# EAGLE design KGGRS2 (EAGLE 8.2.1)
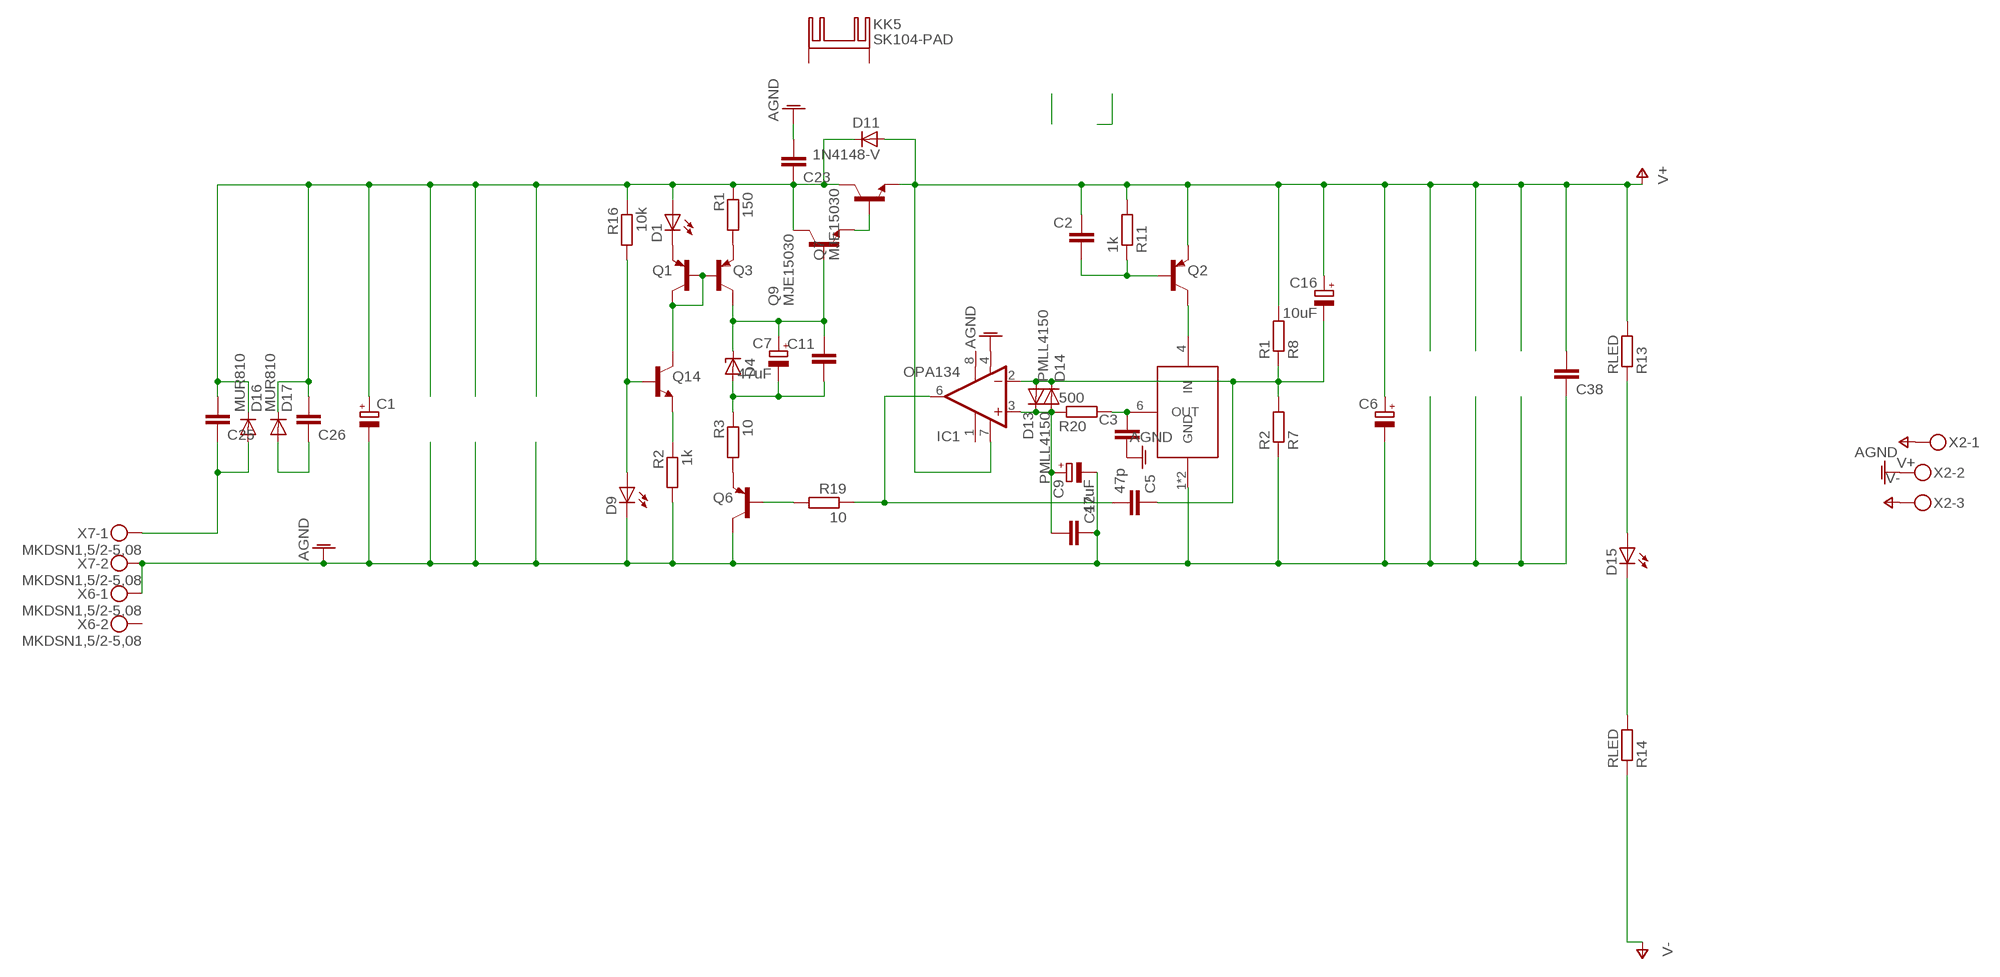
[diagram p0: schematic, sheet 1]

## Parts
C1  CPOL-EUE10-35  [EB35D]
C2  C-EUC1206  [C1206]
C3  C-EUC1206  [C1206]
C5  47p  C-EUC1206  [C1206]
C6  CPOL-EUE5-13  [E5-13]
C7  47uF  CPOL-EUSP-CAP-CX  [SP-CAP-CX]
C9  47uF  CPOL-EUSP-CAP-CX  [SP-CAP-CX]
C11  C-EUC1206  [C1206]
C12  C-EU050-035X075  [C050-035X075]
C16  10uF  CPOL-EUSP-CAP-CX  [SP-CAP-CX]
C23  C-EU050-075X075  [C050-075X075]
C25  C-EU050-035X075  [C050-035X075]
C26  C-EU050-035X075  [C050-035X075]
C38  C-EU050-035X075  [C050-035X075]
D1  LED5MM  [LED5MM]
D4  ZENER-DIODESOD80C  [SOD80C]
D9  LED5MM  [LED5MM]
D11  1N4148-V  [1N4148]
D13  PMLL4150  [SOD80C]
D14  PMLL4150  [SOD80C]
D15  LED5MM  [LED5MM]
D16  MUR810  [TO220ACS]
D17  MUR810  [TO220ACS]
IC1  OPA134  OPA134U  [SO08]
KK5  SK104-PAD  [SK104-PAD]
Q1  MMBTA92LT1-PNP-SOT23-BEC  [SOT23-BEC]
Q2  MMBTA92LT1-PNP-SOT23-BEC  [SOT23-BEC]
Q3  MMBTA92LT1-PNP-SOT23-BEC  [SOT23-BEC]
Q6  MMBTA92LT1-PNP-SOT23-BEC  [SOT23-BEC]
Q7  MJE15030  [TO220KG]
Q9  MJE15030  [TO220KG]
Q14  MMBTA42LT1-NPN-SOT23-BEC  [SOT23-BEC]
R1  150  R-EU_MELF0204W  [MINI_MELF-0204W]
R2  1k  R-EU_MELF0204W  [MINI_MELF-0204W]
R3  10  R-EU_MELF0204W  [MINI_MELF-0204W]
R7  R2  R-EU_MELF0204W  [MINI_MELF-0204W]
R8  R1  R-EU_MELF0204W  [MINI_MELF-0204W]
R11  1k  R-EU_MELF0204W  [MINI_MELF-0204W]
R13  RLED  R-EU_MELF0204W  [MINI_MELF-0204W]
R14  RLED  R-EU_0207/2V  [0207/2V]
R16  10k  R-EU_MELF0204W  [MINI_MELF-0204W]
R19  10  R-EU_MELF0204W  [MINI_MELF-0204W]
R20  500  R-EU_MELF0204W  [MINI_MELF-0204W]
U$1  LTC6654  [SOT-23-6]
X2  MKDSN1,5/3-5,08  [MKDSN1,5/3-5,08]
X6  MKDSN1,5/2-5,08  [MKDSN1,5/2-5,08]
X7  MKDSN1,5/2-5,08  [MKDSN1,5/2-5,08]

## Nets
AGND: C1.- C3.2 C6.- C9.- C12.1 C23.2 C38.1 D9.K(C) IC1.4(V-) Q6.C R2.2 R7.1 U$1.1(GND) U$1.2(GND) X2.2 X6.1 X7.2
N$1: Q1.B Q1.C Q3.B Q14.C
N$2: D1.K(C) Q1.E
N$3: Q3.E R1.2
N$4: C1.+ C23.1 C25.2 C26.2 D1.A D11.C D16.C D17.C Q7.2(C) Q9.2(C) R1.1 R16.1
N$5: C7.+ C11.1 D4.C Q3.C Q9.1(B)
N$6: C7.- C11.2 D4.A R3.1
N$7: Q6.E R3.2
N$8: Q14.E R2.1
N$9: D9.A Q14.B R16.2
N$10: C3.1 R20.2 U$1.6(OUT)
N$11: C2.2 Q2.B R11.1
N$12: Q2.C U$1.4(IN)
N$21: Q7.1(B) Q9.3(E)
N$23: C25.1 D16.A X7.1
N$24: C5.2 IC1.6(OUT) R19.1
N$27: Q6.B R19.2
N$28: C5.1 C16.- D13.A D14.C IC1.2(-IN) R7.2 R8.1
N$31: C9.+ C12.2 D13.C D14.A IC1.3(+IN) R20.1
N$32: D15.K(C) R14.2
N$36: D15.A R13.1
N$59: C26.1 D17.A
V+: C2.1 C6.+ C16.+ C38.2 D11.A IC1.7(V+) Q2.E Q7.3(E) R8.2 R11.2 R13.2 X2.1
V-: R14.1 X2.3
Unconnected: IC1.1(TRIM1) IC1.8(TRIM2) KK5.K1(K) KK5.K2(K) X6.2

## Library data of the parts
C1 C6 C7 C9 C16 = Vwvwbg:CPOL-EU: POLARIZED CAPACITOR, European symbol
C2 C3 C5 C11 C12 C23 C25 C26 C38 = Vwvwbg:C-EU: CAPACITOR, European symbol
D1 D9 D15 = led:LED: LED OSRAM: - CHIPLED LG R971, LG N971, LY N971, LG Q971, LY Q971, LO R971, LY R971 LH N974, LH R974 LS Q976, LO Q976, LY Q976 LO Q996 - Hyper CHIPLED LW Q18S LB Q993, LB Q99A, LB R99A - SideLED LS A670, LO A670, LY A670, LG A670, LP A670 LB A673, LV A673, LT A673, LW A673 LH A674 LY A675 LS A676, LA A676, LO A676, LY A676, LW A676 LS A679, LY A679, LG A679 - Hyper Micro SIDELED® LS Y876, LA Y876, LO Y876, LY Y876 LT Y87S - SmartLED LW L88C, LW L88S LB L89C, LB L89S, LG L890 LS L89K, LO L89K, LY L89K LS L896, LA L896, LO L896, LY L896 - TOPLED LS T670, LO T670, LY T670, LG T670, LP T670 LSG T670, LSP T670, LSY T670, LOP T670, LYG T670 LG T671, LOG T671, LSG T671 LB T673, LV T673, LT T673, LW T673 LH T674 LS T676, LA T676, LO T676, LY T676, LB T676, LH T676, LSB T676, LW T676 LB T67C, LV T67C, LT T67C, LS T67K, LO T67K, LY T67K, LW E67C LS E67B, LA E67B, LO E67B, LY E67B, LB E67C, LV E67C, LT E67C LW T67C LS T679, LY T679, LG T679 LS T770, LO T770, LY T770, LG T770, LP T770 LB T773, LV T773, LT T773, LW T773 LH T774 LS E675, LA E675, LY E675, LS T675 LS T776, LA T776, LO T776, LY T776, LB T776 LHGB T686 LT T68C, LB T68C - Hyper Mini TOPLED® LB M676 - Mini TOPLED Santana® LG M470 LS M47K, LO M47K, LY M47K Source: http://www.osram.convergy.de LUXEON: - LUMILED® LXK2-PW12-R00, LXK2-PW12-S00, LXK2-PW14-U00, LXK2-PW14-V00 LXK2-PM12-R00, LXK2-PM12-S00, LXK2-PM14-U00 LXK2-PE12-Q00, LXK2-PE12-R00, LXK2-PE12-S00, LXK2-PE14-T00, LXK2-PE14-U00 LXK2-PB12-K00, LXK2-PB12-L00, LXK2-PB12-M00, LXK2-PB14-N00, LXK2-PB14-P00, LXK2-PB14-Q00 LXK2-PR12-L00, LXK2-PR12-M00, LXK2-PR14-Q00, LXK2-PR14-R00 LXK2-PD12-Q00, LXK2-PD12-R00, LXK2-PD12-S00 LXK2-PH12-R00, LXK2-PH12-S00 LXK2-PL12-P00, LXK2-PL12-Q00, LXK2-PL12-R00 Source: www.luxeon.com KINGBRIGHT: KA-3528ASYC Source: www.kingbright.com
D4 = diode:ZENER-DIODE: Z-Diode
D11 = diode:1N4148-V
D13 D14 = diode:PMLL4150: DIODE high speed
D16 D17 = diode:MUR810: DIODE
IC1 = burr-brown:OPA134: Operational Amplifiers SoundPlus(TM) High Performance Audio; MF: TEXAS INSTRUMENTS; MPN: OPA134UA; OC_FARNELL: 1097514; OC_NEWARK: 80K6009
KK5 = heatsink:SK104-PAD: HEATSINK manufacturer Fischer/distributor Buerklin
Q1-Q3 Q6 = transistor:*-PNP-: PNP Transistror
Q7 Q9 = transistor:MJE15030
Q14 = transistor:*-NPN-: NPN Transistror BF959 corrected 2008.03.06
R1-R3 R7 R8 R11 R13 R14 R16 R19 R20 = Vwvwbg:R-EU_: RESISTOR, European symbol
U$1 = Vwvwbg:LTC6654
X2 = con-phoenix-508:MKDSN1,5/3-5,08: MKDSN 1,5/ 3-5,08 Printklemme Nennstrom: 13,5 A Nennspannung: 250 V Rastermaß: 5,08 mm Polzahl: 3 Anschlussart: Schraubanschluss Montage: Löten Anschlussrichtung Leiter/Platine: 0 ° Artikelnummer: 1729131 Source: http://eshop.phoenixcontact.com .. 1729131.pdf
X6 X7 = con-phoenix-508:MKDSN1,5/2-5,08: MKDSN 1,5/ 2-5,08 Printklemme Nennstrom: 13,5 A Nennspannung: 250 V Rastermaß: 5,08 mm Polzahl: 2 Anschlussart: Schraubanschluss Montage: Löten Anschlussrichtung Leiter/Platine: 0 ° Artikelnummer: 1729128 Source: http://eshop.phoenixcontact.com .. 1729128.pdf

## Board
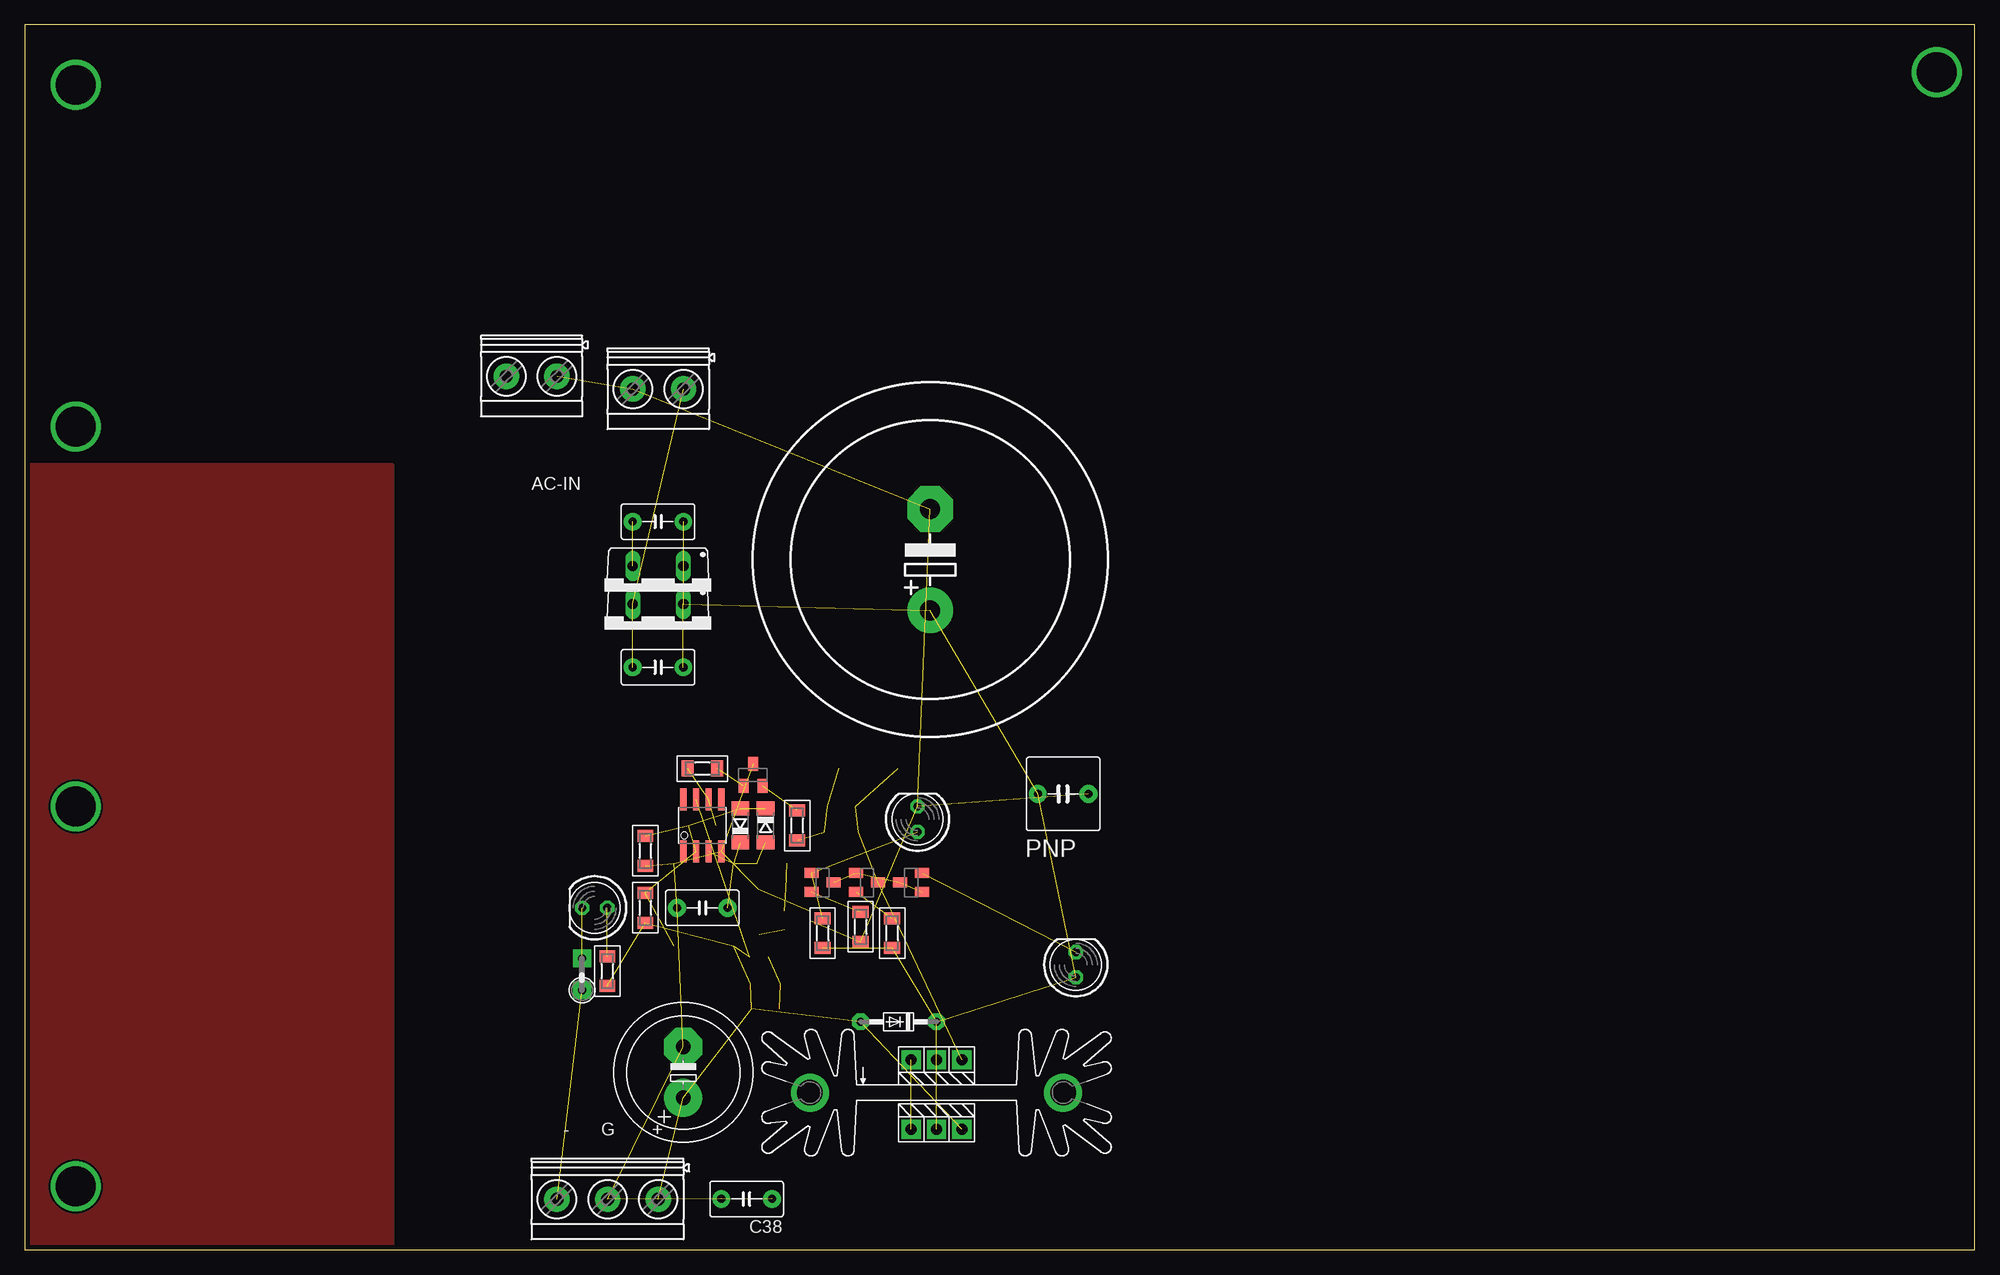
[diagram p1: board, top side]
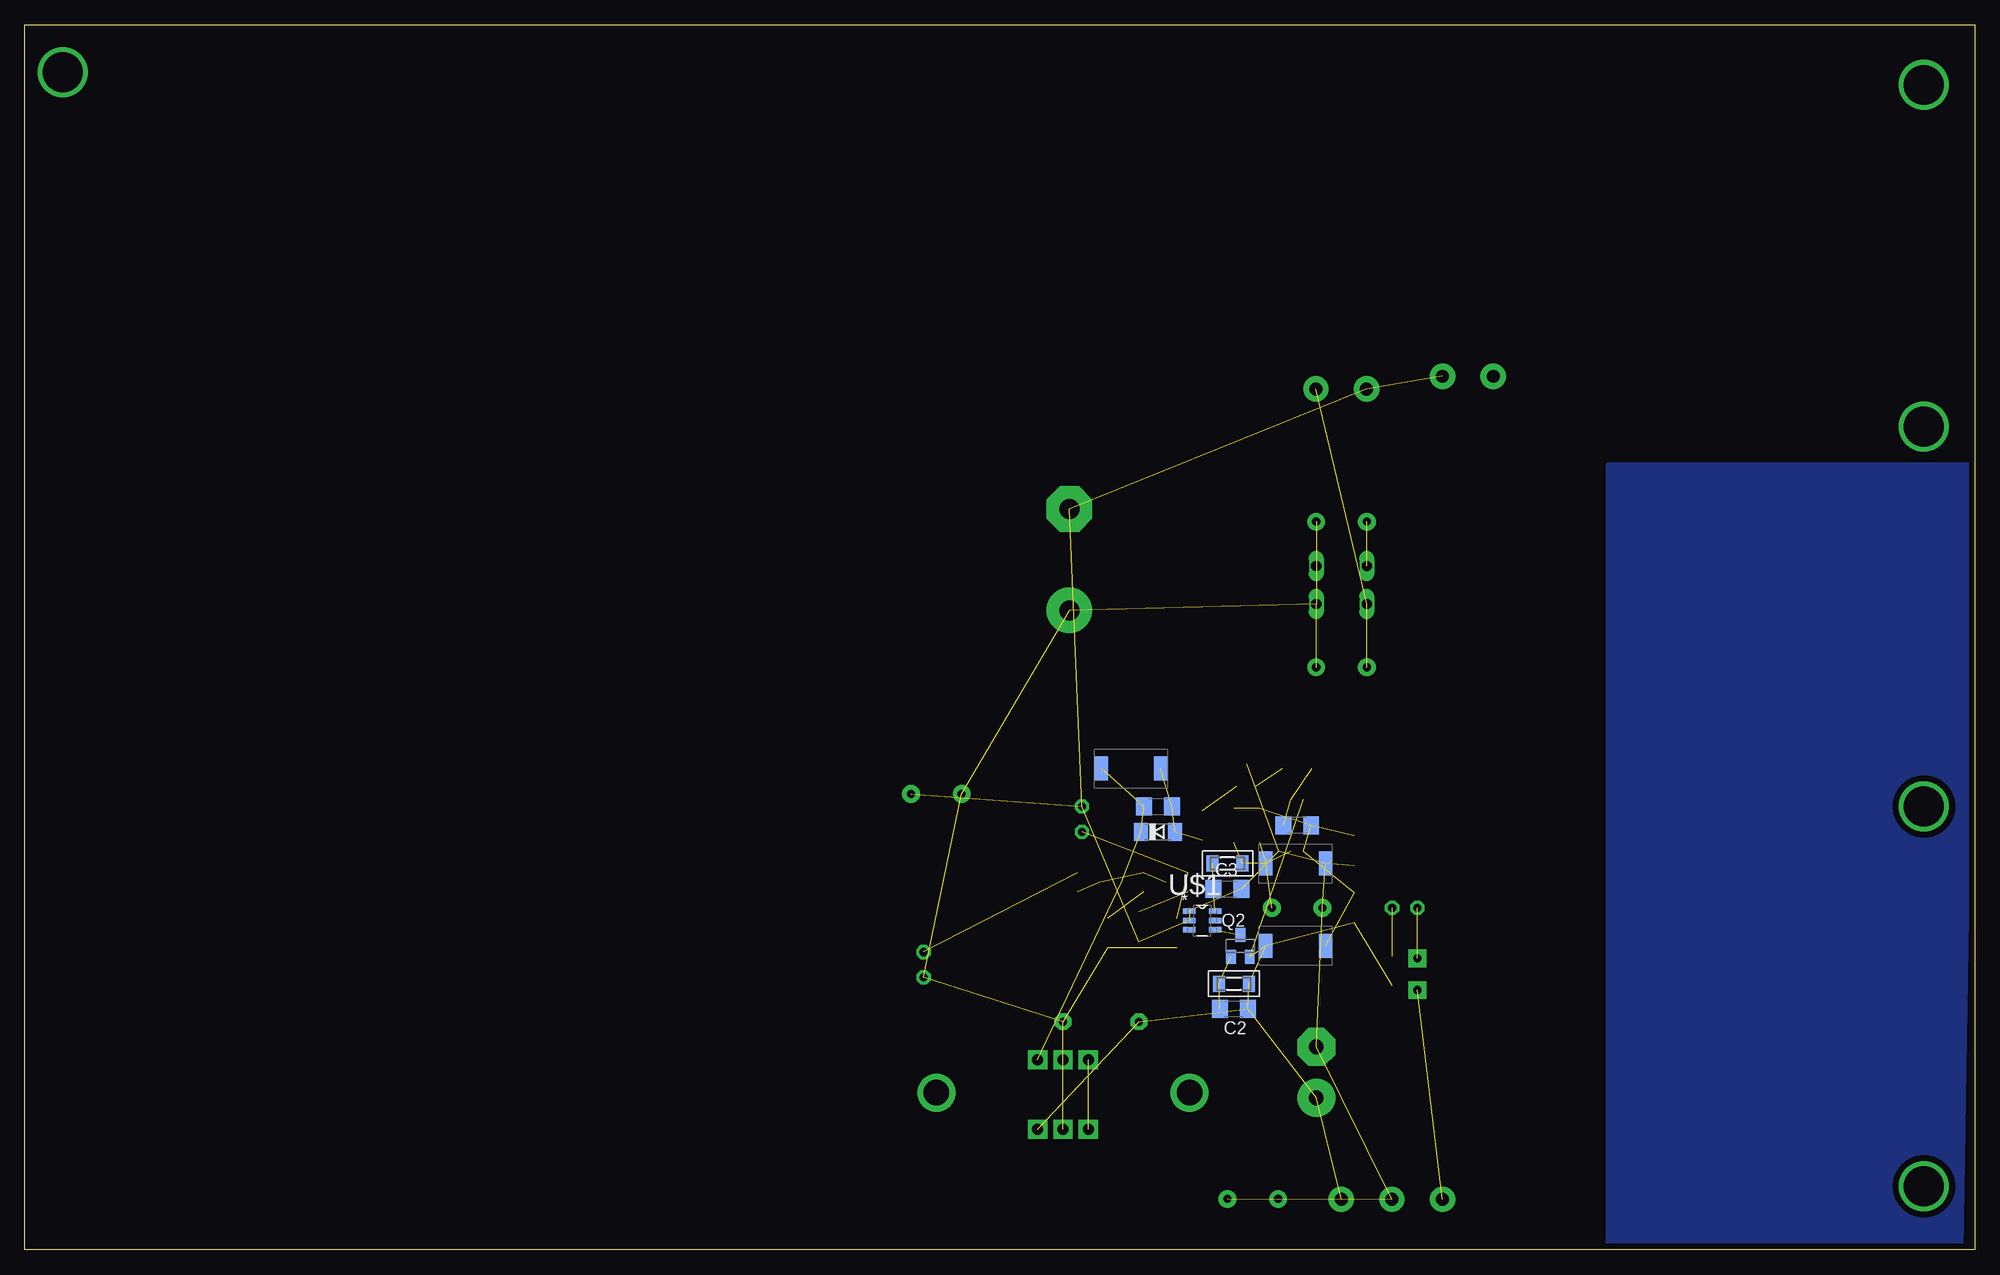
[diagram p2: board, bottom side, seen from below]

Size 195.56 x 122.86 mm. Coordinates in mm from the lower left corner, seen from the top.
Outline: 0,0 195.56,0 195.56,122.86 0,122.86 0,0
Copper layers (1*16): Top 0.035mm / dielectric 1.5mm / Bottom 0.035mm
Design rules "default *": minimum track width 10mil, minimum drill 24mil, track to track 8mil, track to pad 12mil, pad to pad 8mil, via to via 8mil, smd to smd 8mil, copper to edge 20mil, drill to drill 8mil, minimum pad ring 10mil, minimum via ring 8mil, stop-mask expansion 4mil, vias tented up to drill 0mil, thermal gap 10mil

### Footprints (pad centres in the part's own frame; a part is rotated, then mirrored left to right if it is on the bottom)
EB35D = drill 2.007 pad 4.597: + -5.08,0 | drill 2.007 pad 4.597 octagon: - 5.08,0
C1206 = smd 1.6 x 1.8: 1 -1.4,0; 2 1.4,0
E5-13 = drill 1.5 pad 3.81: + -2.54,0 | drill 1.5 pad 3.81 octagon: - 2.54,0
SP-CAP-CX = smd 1.3 x 2.4: + -2.5,0; - 3.453,0
C050-035X075 = drill 0.813 pad 1.778: 1 -2.54,0; 2 2.54,0
C050-075X075 = drill 0.813 pad 1.778: 1 -2.54,0; 2 2.54,0
LED5MM = drill 0.813 pad 1.422 octagon: A -1.27,0; K 1.27,0
SOD80C = smd 1.4 x 1.8: A 1.7,0; C -1.7,0
1N4148 = drill 0.813 pad 1.676 octagon: A 3.81,0; C -3.81,0
TO220ACS = drill 1.016 long: A 2.54,-2.54; C -2.54,-2.54
SO08 = smd 0.61 x 2.21: 1 -1.905,-2.616; 2 -0.635,-2.616; 3 0.635,-2.616; 4 1.905,-2.616; 5 1.905,2.616; 6 0.635,2.616; 7 -0.635,2.616; 8 -1.905,2.616
SK104-PAD = drill 2.54 pad 3.81: K1 -12.7,-0.762; K2 12.7,-0.762
SOT23-BEC = smd 1 x 1.4: B -0.95,-1.1; C 0,1.1; E 0.95,-1.1
TO220KG = drill 1.1 pad 1.93 square: 1 -2.54,0; 2 0,0; 3 2.54,0
MINI_MELF-0204W = smd 1.2 x 1.6: 1 -1.5,0; 2 1.5,0
0207/2V = drill 0.813 pad 1.778 square: 1 -1.27,0; 2 1.905,0
SOT-23-6 = smd 1.27 x 0.559: 1 -1.295,0.94; 2 -1.295,0; 3 -1.295,-0.94; 4 1.295,-0.94; 5 1.295,0; 6 1.295,0.94
MKDSN1,5/3-5,08 = drill 1.3 pad 2.54: 1 -7.641,0.025; 2 -2.561,0.025; 3 2.519,0.025
MKDSN1,5/2-5,08 = drill 1.3 pad 2.54: 1 -2.561,0.025; 2 2.519,0.025

### Placement (x,y rotation side)
C1  90.81,69.22 90 top
C2  74.3,24.13 180 bottom
C3  74.93,36.2 0 bottom
C5  67.94,42.55 180 bottom
C6  66.04,17.78 90 top
C7  85.09,48.26 0 bottom
C9  68.58,38.73 0 bottom
C11  81.92,44.45 0 bottom
C12  67.94,34.29 0 top
C16  68.58,30.48 0 bottom
C23  104.14,45.72 0 top
C25  63.5,58.42 0 top
C26  63.5,73.03 0 top
C38  72.39,5.08 180 top
D1  105.41,28.57 90 top
D4  81.92,41.91 0 bottom
D9  89.53,43.18 90 top
D11  87.63,22.86 180 top
D13  71.75,42.55 90 top
D14  74.3,42.55 270 top
D15  57.15,34.29 180 top
D16  63.5,62.23 180 top
D17  63.5,66.04 180 top
IC1  67.94,42.55 0 top
KK5  91.44,16.51 0 top
Q1  88.9,36.83 90 top
Q2  73.66,30.48 0 bottom
Q3  84.45,36.83 270 top
Q6  73.03,47.62 0 top
Q7  91.44,12.06 0 top
Q9  91.44,19.05 180 top
Q14  80.01,36.83 270 top
R1  87,31.75 90 top
R2  83.82,32.38 270 top
R3  77.47,42.55 90 top
R7  62.23,40.01 90 top
R8  62.23,34.29 270 top
R11  74.3,26.67 0 bottom
R13  58.42,27.94 270 top
R14  55.88,27.3 90 top
R16  80.01,31.75 90 top
R19  67.94,48.26 0 top
R20  74.93,38.73 180 bottom
U$1  77.47,33.02 0 bottom
X2  55.88,5.08 180 top
X6  50.8,87.63 180 top
X7  63.5,86.36 180 top

### Tracks (layer width: path | path; a pad name or v marks a point on that pad's centre or on a via)
AGND  (16 unrouted)
  pour Bottom (isolate 0.61, rank 2): 0,78.74 36.83,78.74 36.83,0 1.27,0
  pour Top: 0,78.74 36.83,78.74 36.83,0 0,0
N$1  (3 unrouted)
N$2  (1 unrouted)
N$3  (1 unrouted)
N$4  (11 unrouted)
N$5  (4 unrouted)
N$6  (3 unrouted)
N$7  (1 unrouted)
N$8  (1 unrouted)
N$9  (2 unrouted)
N$10  (2 unrouted)
N$11  (2 unrouted)
N$12  (1 unrouted)
N$20  (via drill 4)
  other vias: 5.08,6.35
N$21  (1 unrouted)
N$23  (2 unrouted)
N$24  (2 unrouted)
N$27  (1 unrouted)
N$28  (6 unrouted)
N$31  (5 unrouted)
N$32  (1 unrouted)
N$36  (1 unrouted)
N$37  (via drill 4)
  other vias: 5.08,116.84
N$39  (via drill 4)
  other vias: 5.08,44.45
N$59  (1 unrouted)
N$60  (via drill 4)
  other vias: 191.77,118.11
N$80  (via drill 4)
  other vias: 5.08,82.55
V+  (11 unrouted)
V-  (1 unrouted)

### Text on the board
tPlace: AC-IN | PNP | -
tNames: G | +